# Altium schematic sheet UART.SchDoc
size A4
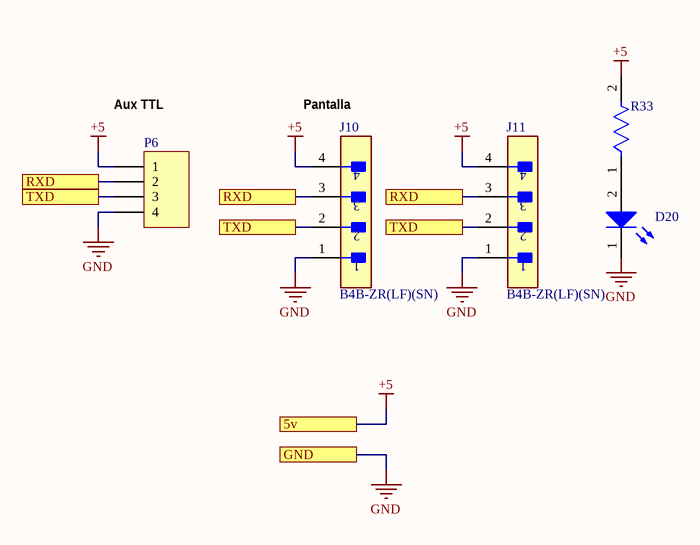
[diagram p0: UART.SchDoc]

## Parts
D20  150080BS75000  [WL-SMCW_0805_150080xx75000]  (value not drawn)
J10  B4B-ZR(LF)(SN)  [FP-B4B-ZR_LF_SN-MFG]
J11  B4B-ZR(LF)(SN)  [FP-B4B-ZR_LF_SN-MFG]
P6  Header 4  [HDR1X4]  (value not drawn)
R33  ERJ-P06F1001V  [FP-ERJP06-IPC_C]  (value not drawn)

## Ports
5v, GND, RXD, TXD

## Nets
+5: J10.4 J11.4 P6.1 R33.2 ; port 5v
GND: D20.1(K) J10.1 J11.1 P6.4 ; port GND
RXD: J10.3 J11.3 P6.2 ; port RXD
TXD: J10.2 J11.2 P6.3 ; port TXD
NetD20_2: D20.2(A) R33.1

## Notes on the sheet
- (near P6) Aux TTL
- (near J10) Pantalla

## Library data of the parts
D20 = CMP-1426-00008-6: NexarPartId: 29717779; Test Current: 20mA; Lens Style: Clear, Rectangular; Forward Current: 100mA; Power Dissipation: 105mW; Dominant Wavelength: 470nm; Reverse Voltage: 5V; Viewing Angle: 140°; Luminous Intensity: 145mcd; Color: Blue; Forward Voltage: 3.2V; Max Junction Temperature (Tj): 95°C; Peak Wavelength: 465nm; Min Operating Temperature: -40°C; Mount: Surface Mount; Case Code (Imperial): 0805; Packaging: Tape and Reel; Lead Free: Lead Free; Length: 2mm; Case/Package: 0805; Case Code (Metric): 2012; Max Operating Temperature: 85°C; Height: 700µm; RoHS: Compliant; Max Reverse Voltage (DC): 5V; REACH SVHC: Unknown; Width: 1.25mm; Wavelength: 470nm
J10 J11 = CMP-17439-000033-1: CONN HEADER VERT 4POS 1.5MM; Max Current Rating: 1A; Max Voltage Rating (AC): 50V; Contact Resistance: 30mR; Body Plating: Tin; Number of Positions: 4; Connector Type: Male Pin; Panel Thickness: 3.5mm; Gender: Male; Insulation Resistance: 500MR; Termination: Solder; Fastening Type: Detent; Housing Material: Polyamide; Voltage Rating (DC): 50V; REACH SVHC: No SVHC; Lead Free: Lead Free; Min Operating Temperature: -25°C; Depth: 3.5mm; Contact Mating Length: 0.094inch; Material: Nylon; Max Operating Temperature: 85°C; Mount: Through Hole; Number of Rows: 1; Orientation: Straight; Current Rating: 1A; Flammability Rating: UL94 V-0; Housing Color: Beige; Length: 7.5mm; Packaging: Bulk; Voltage Rating: 50V; Voltage Rating (AC): 50V; Number of Contacts: 4; Lead Pitch: 1.5mm; Series: ZH; Color: Natural; Contact Plating: Tin; Pitch: 1.5mm; Contact Type: Male Pin; Contact Material: Brass
P6 = Header 4: Header, 4-Pin; LatestRevisionDate: 17-Jul-2002; LatestRevisionNote: Re-released for DXP Platform.; Publisher: Altium Limited
R33 = CMP-05422-000125-1: RES SMD 1K OHM 1% 1/2W 0805; Temperature Coefficient: 100ppm/°C; Max Power Dissipation: 500mW; Voltage Rating: 150V; Resistance: 1kR; Case Code (Metric): 2012; Max Operating Temperature: 155°C; REACH SVHC: No SVHC; Mount: Surface Mount; Military Standard: Not; Package Quantity: 5000; Series: ERJ; Height: 0.6mm; Radiation Hardening: No; Termination: Tab; Number of Terminations: 2; Length: 2mm; Resistance Tolerance: 1%; Voltage Rating (DC): 150V; Depth: 1.25mm; Construction: Rectangular; Resistor Type: Thick Film; Packaging: Tape and Reel; Contact Plating: Tin; RoHS Compliant: Yes; Features: Automotive AEC-Q200; Number of Pins: 2; Case Code (Imperial): 0805; Technology: THICK FILM; Width: 1.2mm; Case/Package: 0805; Min Operating Temperature: -55°C; Power Rating: 500mW; Tolerance: 1%